# Altium schematic sheet modulo_comunicacion_schdoc.SchDoc: Módulo de Comunicación
size 393 x 281 mm; CheckedBy: Santiago Millicay; Author: Diego Coll; DocumentNumber: 1; Revision: 0.0.0; SheetTotal: 1; Organization: Altium Limited; Address1: L3, 12a Rodborough Rd; Address2: Frenchs Forest; Address3: NSW; Address4: Australia 2086; SheetNumber: 1; SheetFormat: A3
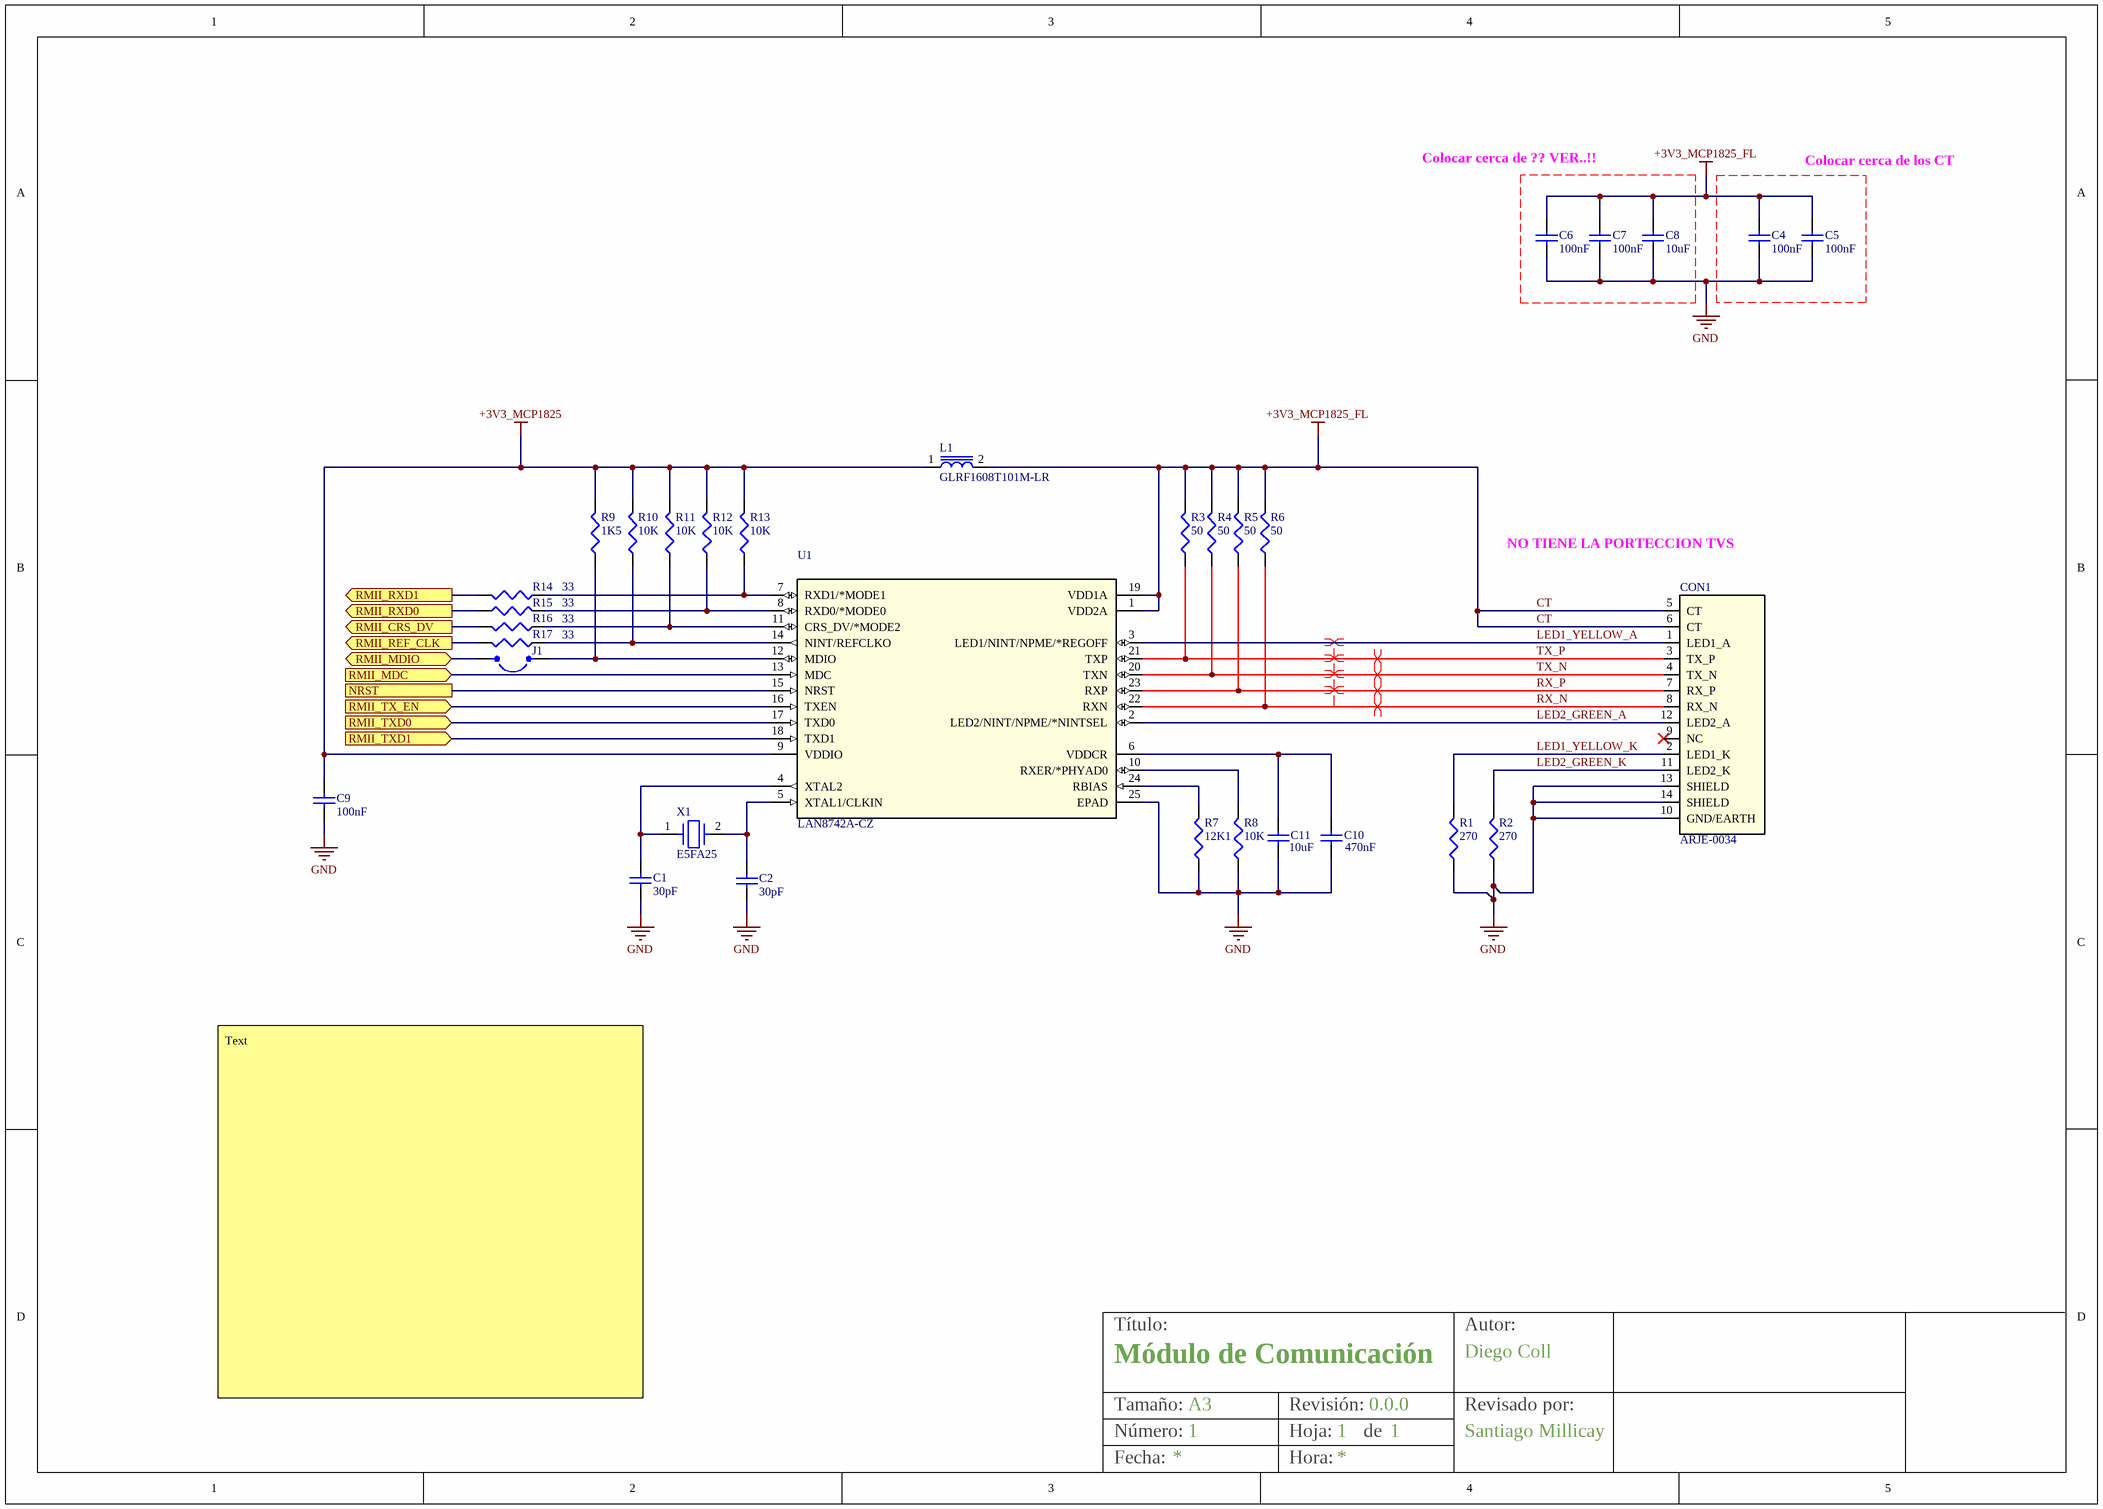
[diagram p0: modulo_comunicacion_schdoc.SchDoc]

## Parts
C1  value 30pF  [1608[0603]]  (hidden comment: Cap Semi)
C2  value 30pF  [1608[0603]]  (hidden comment: Cap Semi)
C4  value 100nF  [1608[0603]]  (hidden comment: Cap Semi)
C5  value 100nF  [1608[0603]]  (hidden comment: Cap Semi)
C6  value 100nF  [1608[0603]]  (hidden comment: Cap Semi)
C7  value 100nF  [1608[0603]]  (hidden comment: Cap Semi)
C8  value 10uF  [1608[0603]]  (hidden comment: Cap Semi)
C9  value 100nF  [1608[0603]]  (hidden comment: Cap Semi)
C10  value 470nF  [C1206]  (hidden comment: Cap Semi)
C11  value 10uF  [C1206]  (hidden comment: Cap Semi)
CON1  ARJE-0034  [ARJE-0034]
J1  JUMPER_SMD_0603  [JUMPER_SMD_0603]  (value not drawn)
L1  GLRF1608T101M-LR  [GLRF1608T101M-LR]
R1  value 270  [J1-0603]  (hidden comment: Res3)
R2  value 270  [J1-0603]  (hidden comment: Res3)
R3  value 50  [J1-0603]  (hidden comment: Res3)
R4  value 50  [J1-0603]  (hidden comment: Res3)
R5  value 50  [J1-0603]  (hidden comment: Res3)
R6  value 50  [J1-0603]  (hidden comment: Res3)
R7  value 12K1  [J1-0603]  (hidden comment: Res3)
R8  value 10K  [J1-0603]  (hidden comment: Res3)
R9  value 1K5  [J1-0603]  (hidden comment: Res3)
R10  value 10K  [J1-0603]  (hidden comment: Res3)
R11  value 10K  [J1-0603]  (hidden comment: Res3)
R12  value 10K  [J1-0603]  (hidden comment: Res3)
R13  value 10K  [J1-0603]  (hidden comment: Res3)
R14  value 33  [J1-0603]  (hidden comment: Res3)
R15  value 33  [J1-0603]  (hidden comment: Res3)
R16  value 33  [J1-0603]  (hidden comment: Res3)
R17  value 33  [J1-0603]  (hidden comment: Res3)
U1  LAN8742A-CZ  [LAN8742A-CZ]
X1  E5FA25  [E5FA25]

## Ports
NRST, RMII_CRS_DV (out), RMII_MDC (in), RMII_MDIO (bidir), RMII_REF_CLK (out), RMII_RXD0 (out), RMII_RXD1 (out), RMII_TX_EN (in), RMII_TXD0 (in), RMII_TXD1 (in)

## Nets
+3V3_MCP1825: C9.2 L1.1 R9.2 R10.2 R11.2 R12.2 R13.2 U1.9(VDDIO)
CT: C4.2 C5.2 C6.2 C7.2 C8.2 CON1.5(CT) CON1.6(CT) L1.2 R3.2 R4.2 R5.2 R6.2 U1.1(VDD2A) U1.19(VDD1A)  [also labelled +3V3_MCP1825_FL]
GND: C1.1 C2.1 C4.1 C5.1 C6.1 C7.1 C8.1 C9.1 C10.1 C11.1 CON1.10(GND/EARTH) CON1.13(SHIELD) CON1.14(SHIELD) R1.1 R2.1 R7.1 R8.1 U1.25(EPAD)
LED1_YELLOW_A: CON1.1(LED1_A) U1.3(LED1/NINT/NPME/*REGOFF)
LED1_YELLOW_K: CON1.2(LED1_K) R1.2
LED2_GREEN_A: CON1.12(LED2_A) U1.2(LED2/NINT/NPME/*NINTSEL)
LED2_GREEN_K: CON1.11(LED2_K) R2.2
NRST: U1.15(NRST) ; port NRST
RMII_CRS_DV: R16.2 ; port RMII_CRS_DV
RMII_MDC: U1.13(MDC) ; port RMII_MDC
RMII_MDIO: J1.1 ; port RMII_MDIO
RMII_REF_CLK: R17.2 ; port RMII_REF_CLK
RMII_RXD0: R15.1 ; port RMII_RXD0
RMII_RXD1: R14.2 ; port RMII_RXD1
RMII_TX_EN: U1.16(TXEN) ; port RMII_TX_EN
RMII_TXD0: U1.17(TXD0) ; port RMII_TXD0
RMII_TXD1: U1.18(TXD1) ; port RMII_TXD1
RX_N: CON1.8(RX_N) R6.1 U1.22(RXN)
RX_P: CON1.7(RX_P) R5.1 U1.23(RXP)
TX_N: CON1.4(TX_N) R4.1 U1.20(TXN)
TX_P: CON1.3(TX_P) R3.1 U1.21(TXP)
NetC1_2: C1.2 U1.4(XTAL2) X1.1
NetC2_2: C2.2 U1.5(XTAL1/CLKIN) X1.2
NetC10_2: C10.2 C11.2 U1.6(VDDCR)
NetJ1_2: J1.2 R9.1 U1.12(MDIO)
NetR7_2: R7.2 U1.24(RBIAS)
NetR8_2: R8.2 U1.10(RXER/*PHYAD0)
NetR10_1: R10.1 R17.1 U1.14(NINT/REFCLKO)
NetR11_1: R11.1 R16.1 U1.11(CRS_DV/*MODE2)
NetR12_1: R12.1 R15.2 U1.8(RXD0/*MODE0)
NetR13_1: R13.1 R14.1 U1.7(RXD1/*MODE1)

Not connected (* = marked no-connect by the designer): CON1 9(NC)*

## Layout directives
differential pair: RX_N, RX_P, TX_N, TX_P

## Notes on the sheet
- Colocar cerca de ?? VER..!!
- Colocar cerca de los CT
- NO TIENE LA PORTECCION TVS
- Text
- Título:
- Autor:
- Tamaño:
- Número:
- Fecha:
- Revisión:
- Hoja:
- Hora:
- de
- Revisado por:

## Library data of the parts
C1 C2 C4-C11 = Cap Semi: Capacitor (Semiconductor SIM Model); Published: 8-Jun-2000; LatestRevisionDate: 29-May-2009; LatestRevisionNote: IPC-7351 Footprint Added.; PackageReference: C1206; Publisher: Altium Limited; PackageDescription: Chip Capacitor
CON1 = ARJE-0034_MOD: CONECTOR RJ45 MAGNETICO; Manufacturer: Abracon; Current Rating: 8mA; Direction: Up; Gender: Male; Number of Contacts: 8; Number of Cores per Jack: 4; Number of Ports: 1; Number of Positions: 12; Pitch: 1.02mm; Shielding: Shielded; Category: Modular / Ethernet Connectors; Color: Green,Yellow; Connector Type: RJ45; Lead Free: Lead Free; Manufacturer Part Number: ARJE-0034; Max Operating Temperature: 70°C; Min Operating Temperature: 0°C; Mount: Surface Mount; Number of Rows: 1; Orientation: Right Angle; Package Quantity: 1; Packaging: Tape and Reel; Radiation Hardening: No; Termination: Solder
L1 = GLRF1608T101M-LR: FIXED IND 100UH 80MA 5.5 OHM SMD; Manufacturer: TDK; Manufacturer Part Number: GLFR1608T101M-LR; Current Rating: 25mA; DC Resistance (DCR): 5.5R; Shielding: Shielded; Tolerance: 20%; Case Code (Imperial): 0603; Case Code (Metric): 1608; Case/Package: 0603; Category: Fixed Inductors; DC Current: 80mA; Depth: 1mm; Height: 0.031inch; Inductance: 100uH; Lead Free: Lead Free; Length: 0.063inch; Max DC Current: 80mA; Max Operating Temperature: 105°C; Military Standard: Not; Min Operating Temperature: -40°C; Mount: Surface Mount; Package Quantity: 4000; Packaging: Tape and Reel; Saturation Current: 25mA; Termination: SMD/SMT; Width: 0.8mm; Supplier 1: Digi-Key; RoHS: Yes; Stock 1: 31108; Pricing 1: 1=0,27000, 10=0,24400, 100=0,16760, 500=0,14324, 1000=0,10971 (USD); ComponentLink1URL: https://datasheet.ciiva.com/1040/glfrseries-1040797.pdf?src-supplier=Digi-Key; ComponentLink1Description: https://datasheet.ciiva.com/1040/glfrseries-1040797.pdf?src-supplier=Digi-Key; ComponentLink2URL: https://datasheet.ciiva.com/1040/glfrseries-1040798.pdf?src-supplier=Digi-Key; ComponentLink2Description: https://datasheet.ciiva.com/1040/glfrseries-1040798.pdf?src-supplier=Digi-Key; ComponentLink3URL: https://datasheet.ciiva.com/1040/glfrseries-1040799.pdf?src-supplier=Digi-Key; ComponentLink3Description: https://datasheet.ciiva.com/1040/glfrseries-1040799.pdf?src-supplier=Digi-Key
R1-R17 = Res3: Resistor; Published: 8-Jun-2000; LatestRevisionDate: 29-May-2009; LatestRevisionNote: IPC-7351 Footprint Added.; PackageReference: J1-0603; Publisher: Altium Limited; PackageDescription: Chip Resistor
U1 = LAN8742A-CZ_MOD: IC TRANSCEIVER 1/1 24SQFN; Manufacturer: Microchip; Manufacturer Part Number: LAN8742A-CZ; Category: Interface ICs
X1 = E5FA25: E5FA 25.0000 F15 E33